# Altium project CamBienAnhSang.PrjPcb
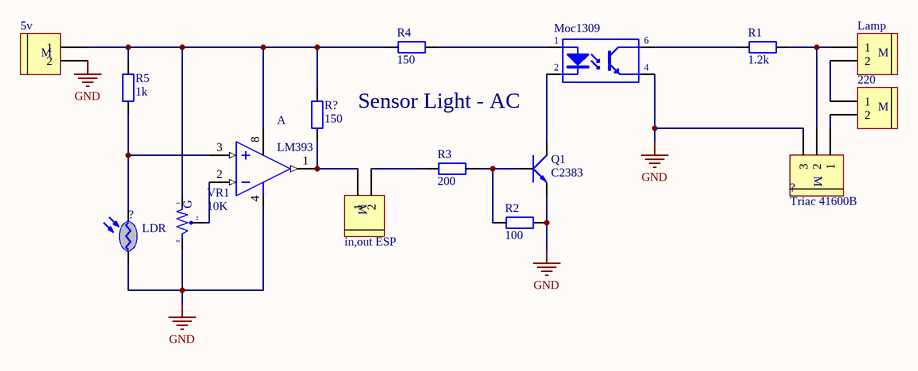
[diagram p0: Sheet1.SchDoc]
1 sheet, 16 parts. Net scope: global (net labels, ports and power ports of the same name join across sheets).
Board file: PCB1.PcbDoc

## Sheet Sheet1.SchDoc
size A4

### Parts
(Parts that share a designator on the sheet are numbered #1, #2 ... from top to bottom, then left to right.)
5v  (no value)  [Medium - Header 2]
220  (no value)  [Medium - Header 2]
?#1  Triac 41600B  [Medium - Header 3]
?#2  LDR  [CDS]
in,out_ESP  (no value)  [Medium - Header 2]
Lamp  (no value)  [Medium - Header 2]
Moc1309  (no value)  [DIP6/W0.3]
Q1  C2383  [QTO-92]
R1  1.2k  [R1/4W]
R2  100  [R1/4W]
R3  200  [R1/4W]
R4  150  [R1/4W]
R5  1k  [R1/4W]
R?  150  [R1/4W]
VR1  10K  [VR-S3]
  LM393  [DIP8]  (part A of 2)

### Nets
GND: 5v.2 ?#1.3 ?#2.1(A) Moc1309.4(E) Q1.1(E) R2.2 VR1.3 .4(-V)
Net5v_1: 5v.1 R4.1 R5.2 R?.2 VR1.1 .8(+V)
Net220_1: 220.1 Lamp.2
Net220_2: 220.2 ?#1.1
Net?#1_2: ?#1.2 Lamp.1 R1.2
Net?#2_2: ?#2.2(K) R5.1 .3(IN+)
Netin,out_ESP_1: in,out_ESP.1 R?.1 .1(OUT)
Netin,out_ESP_2: in,out_ESP.2 R3.1
NetMoc1309_1: Moc1309.1(A) R4.2
NetMoc1309_2: Moc1309.2(K) Q1.2(C)
NetMoc1309_6: Moc1309.6(C) R1.1
NetQ1_3: Q1.3(B) R2.1 R3.2
NetVR1_2: VR1.2 .2(IN-)

### Notes on the sheet
- (near Moc1309) Sensor Light - AC
- (in symbol Header 2 - M) M
- (in symbol Header 3 - M) M
- (in symbol VR-S) G

### Library data of the parts
5v 220 in,out_ESP Lamp = Header 2 - M: Header, 2-Pin, Medium; LatestRevisionDate: 17-Jul-2002; LatestRevisionNote: Re-released for DXP Platform.; Publisher: Altium Limited
?#1 = Header 3 - M: Header, 3-Pin, Medium; LatestRevisionDate: 17-Jul-2002; LatestRevisionNote: Re-released for DXP Platform.; Publisher: Altium Limited
?#2 = LDR: Quang Tro
Moc1309 = MOC3021: Single Opto; Value: MOC3021
Q1 = C1815: NPN 600mW, ECB; Value: C1815
R1-R5 R? = R1/4W: Resistor 1/4W; Value: R1/4W - 1K
VR1 = VR-S: Var Resistor; Value: Volume 50k
 = LM358: Low-Power Dual Operational Amplifier; Value: LM358